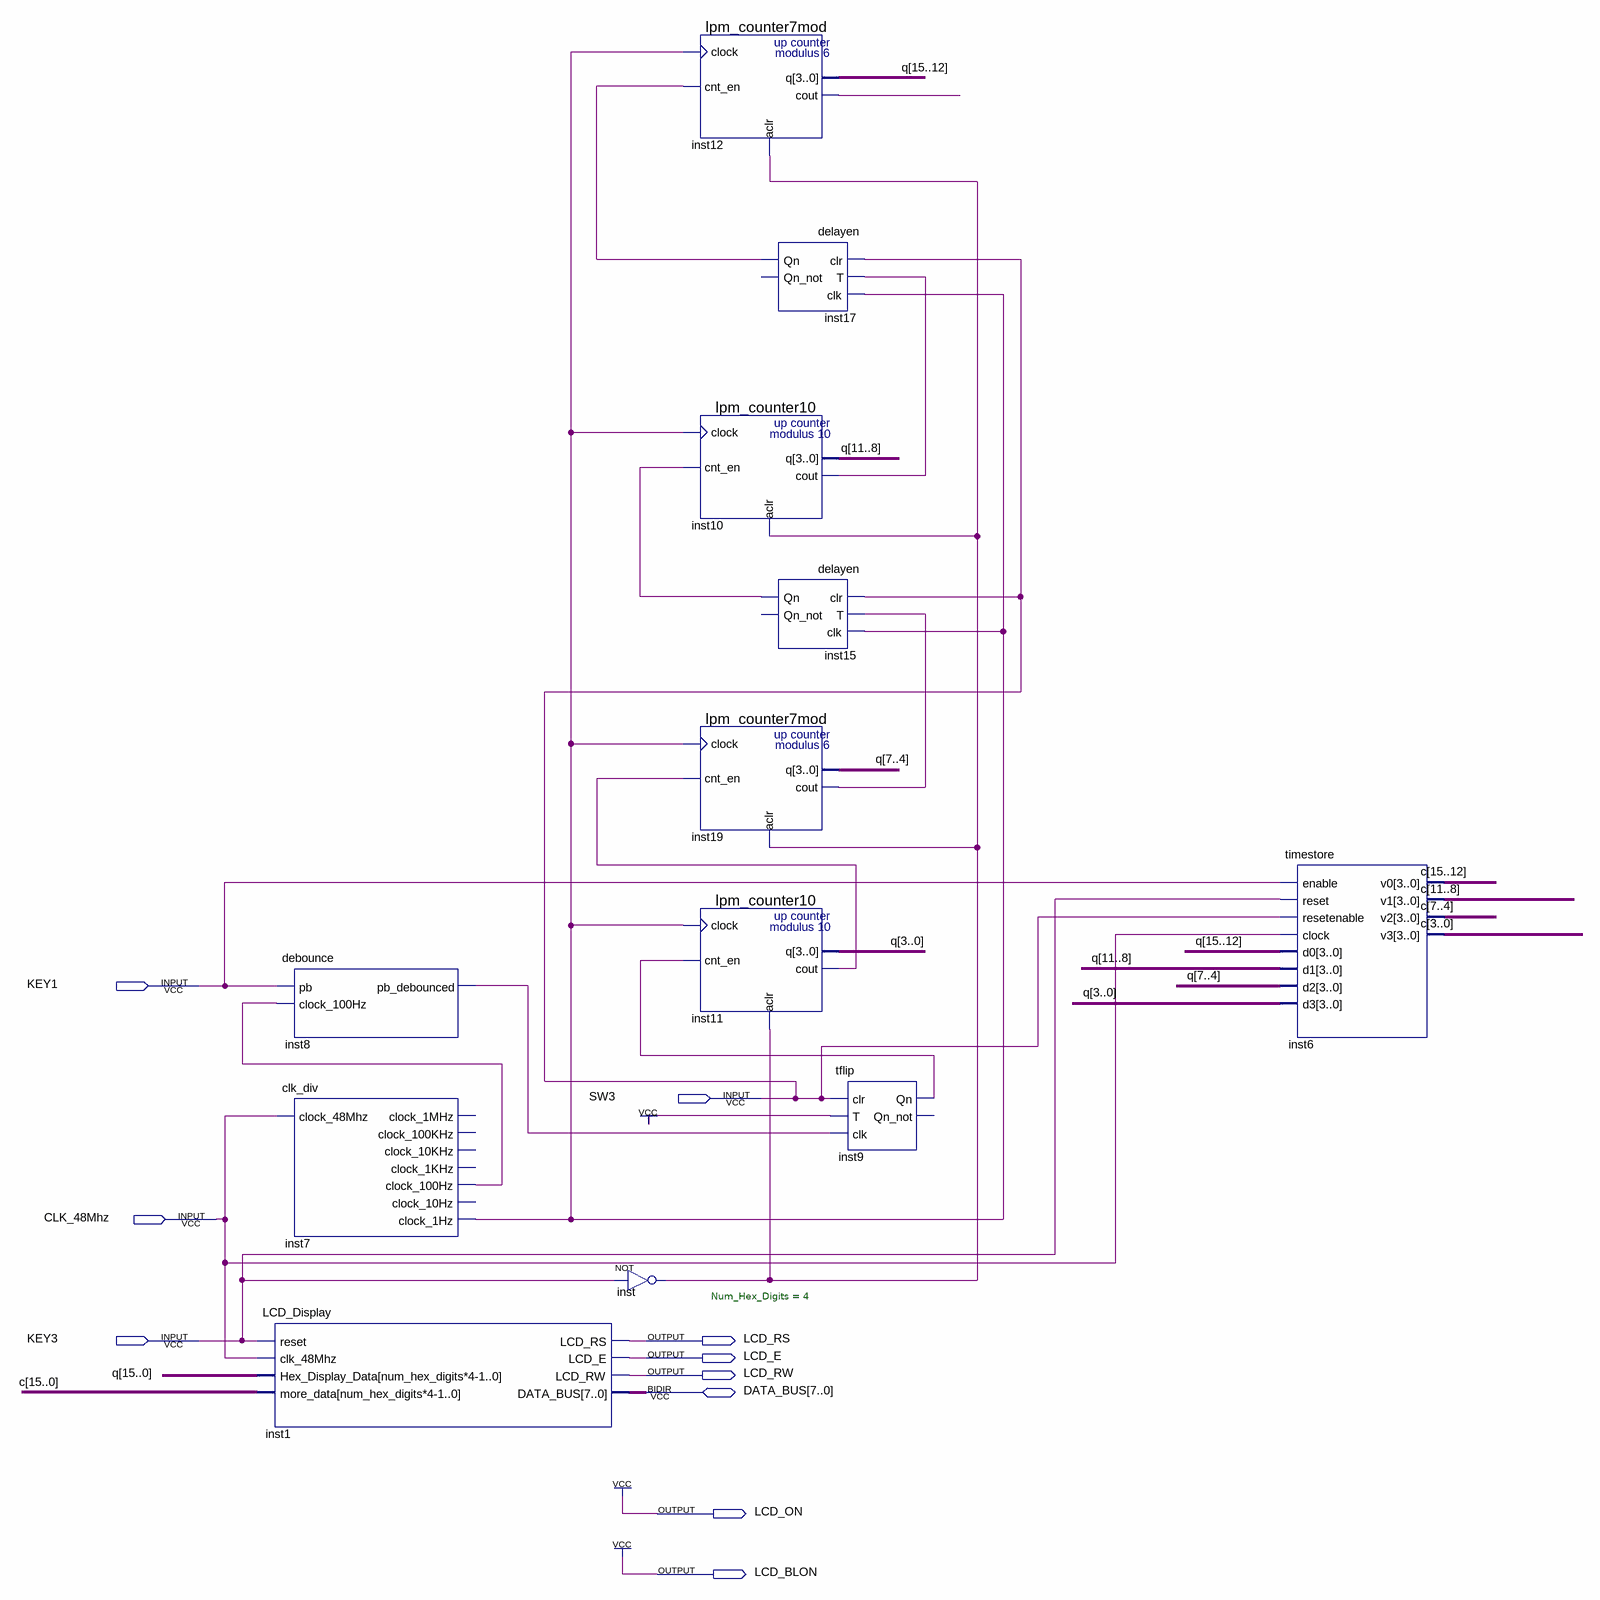
[diagram p0: schematic sheet]
// Quartus schematic tutor2.bdf as structural Verilog: 12 symbols, 10 pins
module tutor2 (
  input  KEY1,
  input  SW3,
  input  CLK_48Mhz,
  input  KEY3,
  inout  [7:0] DATA_BUS,
  output LCD_RS,
  output LCD_E,
  output LCD_RW,
  output LCD_ON,
  output LCD_BLON
);

  wire inst7_clock_1hz, inst7_clock_100hz, inst8_pb_debounced, inst9_qn, inst10_cout, inst11_cout,
       inst12_cout, inst15_qn, inst17_qn, inst19_cout, inst_out;
  wire [15:0] c, q;

  LCD_Display #(.Num_Hex_Digits(4)) inst1 (
    .reset(KEY3), .clk_48Mhz(CLK_48Mhz), .Hex_Display_Data(q), .more_data(c), .LCD_RS(LCD_RS), .LCD_E(LCD_E),
    .LCD_RW(LCD_RW), .DATA_BUS(DATA_BUS));
  debounce inst8 (.pb(KEY1), .clock_100Hz(inst7_clock_100hz), .pb_debounced(inst8_pb_debounced));
  clk_div inst7 (
    .clock_48Mhz(CLK_48Mhz), .clock_100Hz(inst7_clock_100hz), .clock_1Hz(inst7_clock_1hz));  // open: clock_1MHz, clock_100KHz, clock_10KHz, clock_1KHz, clock_10Hz
  not inst (inst_out, KEY3);
  lpm_counter7mod inst12 (
    .clock(inst7_clock_1hz), .cnt_en(inst17_qn), .aclr(inst_out), .q(q[15:12]), .cout(inst12_cout));
  lpm_counter10 inst10 (.clock(inst7_clock_1hz), .cnt_en(inst15_qn), .aclr(inst_out), .q(q[11:8]), .cout(inst10_cout));
  lpm_counter7mod inst19 (
    .clock(inst7_clock_1hz), .cnt_en(inst11_cout), .aclr(inst_out), .q(q[7:4]), .cout(inst19_cout));
  lpm_counter10 inst11 (.clock(inst7_clock_1hz), .cnt_en(inst9_qn), .aclr(inst_out), .q(q[3:0]), .cout(inst11_cout));
  delayen inst17 (.clr(SW3), .T(inst10_cout), .clk(inst7_clock_1hz), .Qn(inst17_qn));  // open: Qn_not
  delayen inst15 (.clr(SW3), .T(inst19_cout), .clk(inst7_clock_1hz), .Qn(inst15_qn));  // open: Qn_not
  tflip inst9 (.clr(SW3), .T(1'b1), .clk(inst8_pb_debounced), .Qn(inst9_qn));  // open: Qn_not
  timestore inst6 (
    .enable(KEY1), .reset(KEY3), .resetenable(SW3), .clock(CLK_48Mhz), .d0(q[15:12]), .d1(q[11:8]),
    .d2(q[7:4]), .d3(q[3:0]), .v0(c[15:12]), .v1(c[11:8]), .v2(c[7:4]), .v3(c[3:0]));

  assign LCD_BLON = 1'b1;
  assign LCD_ON = 1'b1;
endmodule
